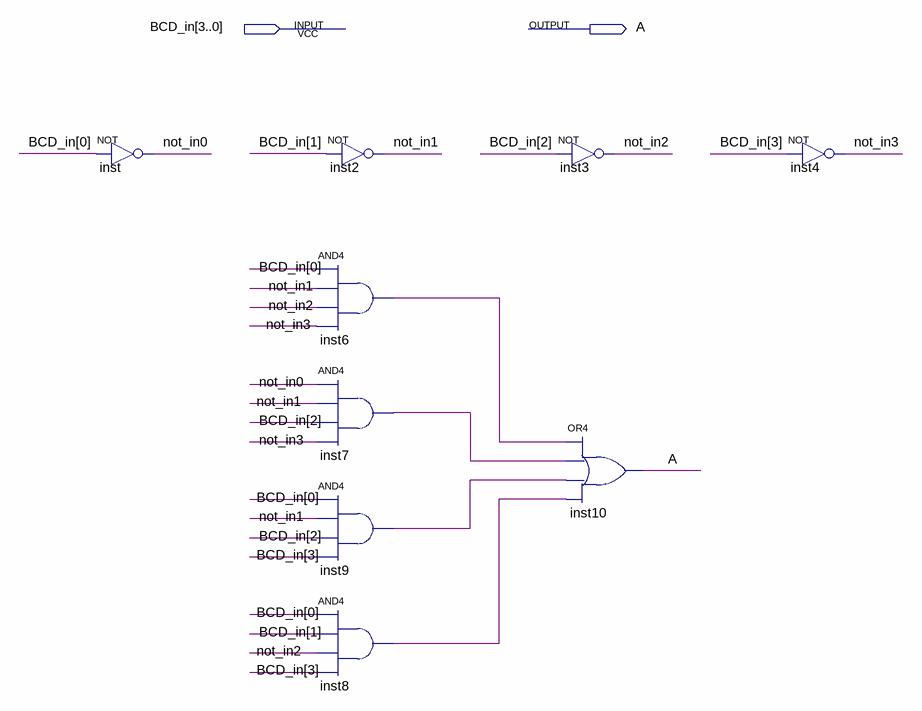
[diagram p0: schematic sheet]
// Quartus schematic A.bdf as structural Verilog: 9 symbols, 2 pins
module A (
  input  [3:0] BCD_in,
  output A
);

  wire inst6_out, inst7_out, inst8_out, inst9_out, not_in0, not_in1, not_in2, not_in3;

  not inst (not_in0, BCD_in[0]);
  not inst2 (not_in1, BCD_in[1]);
  and inst6 (inst6_out, BCD_in[0], not_in1, not_in2, not_in3);
  and inst7 (inst7_out, not_in0, not_in1, BCD_in[2], not_in3);
  and inst9 (inst9_out, BCD_in[0], not_in1, BCD_in[2], BCD_in[3]);
  and inst8 (inst8_out, BCD_in[0], BCD_in[1], not_in2, BCD_in[3]);
  not inst3 (not_in2, BCD_in[2]);
  or inst10 (A, inst6_out, inst7_out, inst9_out, inst8_out);
  not inst4 (not_in3, BCD_in[3]);
endmodule
